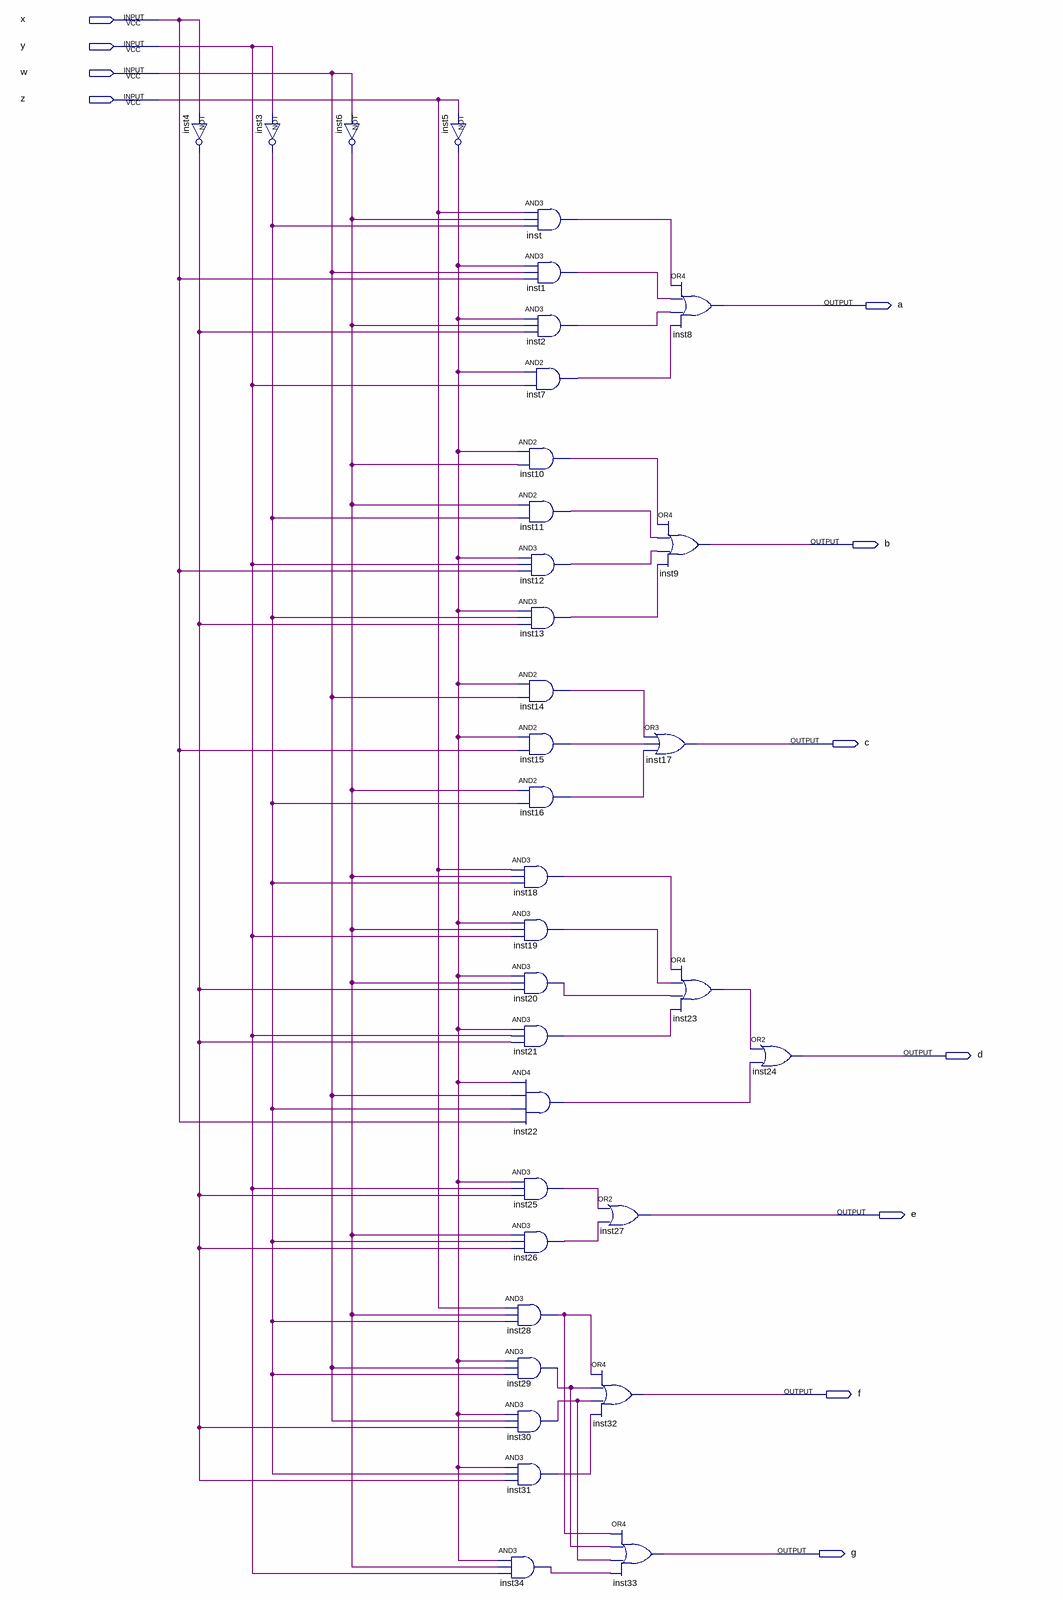
[diagram p0: schematic sheet]
// Quartus schematic BDCto7segments.bdf as structural Verilog: 35 symbols, 11 pins
module BDCto7segments (
  input  x,
  input  y,
  input  w,
  input  z,
  output a,
  output b,
  output c,
  output d,
  output e,
  output f,
  output g
);

  wire inst1_out, inst2_out, inst3_out, inst4_out, inst5_out, inst6_out, inst7_out, inst10_out, inst11_out,
       inst12_out, inst13_out, inst14_out, inst15_out, inst16_out, inst18_out, inst19_out, inst20_out,
       inst21_out, inst22_out, inst23_out, inst25_out, inst26_out, inst28_out, inst29_out, inst30_out,
       inst31_out, inst34_out, inst_out;

  not inst4 (inst4_out, x);
  not inst3 (inst3_out, y);
  not inst6 (inst6_out, w);
  not inst5 (inst5_out, z);
  and inst (inst_out, z, inst6_out, inst3_out);
  and inst1 (inst1_out, inst5_out, w, x);
  and inst2 (inst2_out, inst5_out, inst6_out, inst4_out);
  and inst7 (inst7_out, inst5_out, y);
  and inst10 (inst10_out, inst5_out, inst6_out);
  and inst11 (inst11_out, inst6_out, inst3_out);
  and inst12 (inst12_out, inst5_out, y, x);
  and inst13 (inst13_out, inst5_out, inst3_out, inst4_out);
  and inst14 (inst14_out, inst5_out, w);
  and inst15 (inst15_out, inst5_out, x);
  and inst16 (inst16_out, inst6_out, inst3_out);
  and inst18 (inst18_out, z, inst6_out, inst3_out);
  and inst19 (inst19_out, inst5_out, inst6_out, y);
  and inst20 (inst20_out, inst5_out, inst6_out, inst4_out);
  and inst21 (inst21_out, inst5_out, y, inst4_out);
  and inst22 (inst22_out, inst5_out, w, inst3_out, x);
  and inst25 (inst25_out, inst5_out, y, inst4_out);
  and inst26 (inst26_out, inst6_out, inst3_out, inst4_out);
  and inst28 (inst28_out, z, inst6_out, inst3_out);
  and inst29 (inst29_out, inst5_out, w, inst3_out);
  and inst30 (inst30_out, inst5_out, w, inst4_out);
  and inst31 (inst31_out, inst5_out, inst3_out, inst4_out);
  and inst34 (inst34_out, inst5_out, inst6_out, y);
  or inst32 (f, inst28_out, inst29_out, inst30_out, inst31_out);
  or inst17 (c, inst14_out, inst15_out, inst16_out);
  or inst27 (e, inst25_out, inst26_out);
  or inst33 (g, inst28_out, inst29_out, inst30_out, inst34_out);
  or inst8 (a, inst_out, inst1_out, inst2_out, inst7_out);
  or inst9 (b, inst10_out, inst11_out, inst12_out, inst13_out);
  or inst23 (inst23_out, inst18_out, inst19_out, inst20_out, inst21_out);
  or inst24 (d, inst23_out, inst22_out);
endmodule
